# Altium schematic sheet Power.SchDoc
size A; SheetNumber: 1; SheetTotal: 8
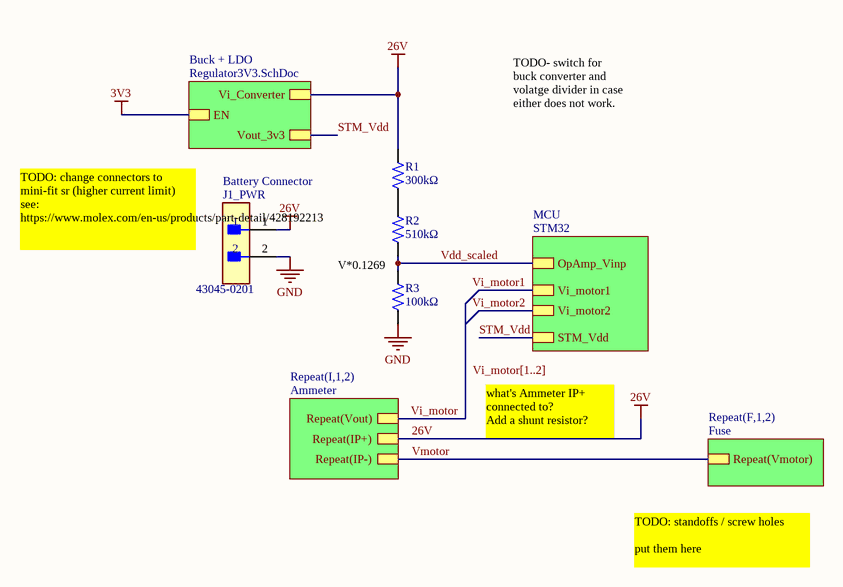
[diagram p0: Power.SchDoc]

## Parts
J1_PWR  43045-0201  [FP-43045-0201-MFG]
R1  Resistance: 300kΩ  [RES-0603]  (hidden comment: 0603WAF3003T5E)
R2  Resistance: 510kΩ  [RES-0603]  (hidden comment: 0603WAF5103T5E)
R3  Resistance: 100kΩ  [RES-0402]  (hidden comment: 0402WGF1003TCE)

## Sub-sheets
Buck + LDO = Regulator3V3.SchDoc: Vi_Converter, Vout_3v3, EN
MCU = STM32: Vi_motor1, Vi_motor2, OpAmp_Vinp, STM_Vdd
Repeat(F,1,2) = Fuse: Repeat(Vmotor)
Repeat(I,1,2) = Ammeter: Repeat(Vout), Repeat(IP-), Repeat(IP+)

## Nets
3V3: sheet Buck + LDO/EN
26V: J1_PWR.1 R1.2 ; sheet Repeat(I,1,2)/Repeat(IP+), sheet Buck + LDO/Vi_Converter
GND: J1_PWR.2 R3.1
STM_Vdd: sheet MCU/STM_Vdd, sheet Buck + LDO/Vout_3v3
Vdd_scaled: R2.1 R3.2 ; sheet MCU/OpAmp_Vinp
Vi_motor: sheet Repeat(I,1,2)/Repeat(Vout)
Vi_motor1: sheet MCU/Vi_motor1
Vi_motor2: sheet MCU/Vi_motor2
Vmotor: sheet Repeat(I,1,2)/Repeat(IP-), sheet Repeat(F,1,2)/Repeat(Vmotor)
NetR1_1: R1.1 R2.2

## Buses and harness runs
bus Vi_motor[1..2]

## Notes on the sheet
- (near J1_PWR) Battery Connector
- TODO- switch for buck converter and volatge divider in case either does not work.
- TODO: change connectors to mini-fit sr (higher current limit)
  see: https://www.molex.com/en-us/products/part-detail/428192213
- V*0.1269
- what's Ammeter IP+ connected to?
  Add a shunt resistor?
- TODO: standoffs / screw holes
  put them here
- Labels drawn without touching a wire or pin: Vi_motor[1..2]

## Library data of the parts
J1_PWR = CMP-04776-000998-1: CONN HEADER R/A 2POS; Number of Circuits: 2; Glow Wire Compliant: Compliant; Pitch: 3mm; Max Voltage Rating (DC): 250.25kV; Current Rating: 5A; Contact Resistance: 10mR; Gender: Male; Voltage Rating: 250V; Number of Positions: 2; Halogen Free: Low Halogen; Series: 43045; Mount: Through Hole; Packaging: Tray; Row Spacing: 3mm; Contact Material: Brass; Radiation Hardening: No; Number of Contacts: 2; Orientation: Right Angle; Max Operating Temperature: 105°C; Housing Material: Thermoplastic; Contact Plating: Gold; Case/Package: 0201; Number of Rows: 2; Min Operating Temperature: -40°C; Termination: Solder; Package Quantity: 3168
R1 = 0603WAF3003T5E: Resistor, 300kΩ, ±1%, 100mW, 75V, ±100ppm/℃, -55℃~+155℃, SMD 0603; Manufacturer: Uniroyal; Supplier 1: LCSC; Manufacturer Part Number: 0603WAF3003T5E; Supplier Part Number 1: C23024; JLCPCB Part Number: C23024; Power Rating: 100mW; Category: Resistors; Package Size: 0603; JLCPCB Basic Part: Yes; Tolerance: ±1%; Voltage Rating: 75V; Temperature Coefficient: ±100ppm/℃; Temperature Rating: -55℃~+155℃; ComponentLink1Description: Datasheet; ComponentLink1URL: https://wmsc.lcsc.com/wmsc/upload/file/pdf/v2/lcsc/2206010116_UNI-ROYAL-Uniroyal-Elec-0603WAF3003T5E_C23024.pdf; ComponentLink2Description: JLCPCB Part URL; ComponentLink2URL: https://jlcpcb.com/partdetail/C23024
R2 = 0603WAF5103T5E: Resistor, 510kΩ, ±1%, 100mW, 75V, ±100ppm/℃, -55℃~+155℃, SMD 0603; Manufacturer: Uniroyal; Supplier 1: LCSC; Manufacturer Part Number: 0603WAF5103T5E; Supplier Part Number 1: C23192; JLCPCB Part Number: C23192; Power Rating: 100mW; Category: Resistors; Package Size: 0603; JLCPCB Basic Part: Yes; Tolerance: ±1%; Voltage Rating: 75V; Temperature Coefficient: ±100ppm/℃; Temperature Rating: -55℃~+155℃; ComponentLink1Description: Datasheet; ComponentLink1URL: https://wmsc.lcsc.com/wmsc/upload/file/pdf/v2/lcsc/2206010116_UNI-ROYAL-Uniroyal-Elec-0603WAF5103T5E_C23192.pdf; ComponentLink2Description: JLCPCB Part URL; ComponentLink2URL: https://jlcpcb.com/partdetail/C23192
R3 = 0402WGF1003TCE: Resistor, 100kΩ, ±1%, 62.5mW, 50V, ±100ppm/℃, -55℃~+155℃, SMD 0402; Manufacturer: Uniroyal; Supplier 1: LCSC; Manufacturer Part Number: 0402WGF1003TCE; Supplier Part Number 1: C25741; JLCPCB Part Number: C25741; Power Rating: 62.5mW; Category: Resistors; Package Size: 0402; JLCPCB Basic Part: Yes; Tolerance: ±1%; Voltage Rating: 50V; Temperature Coefficient: ±100ppm/℃; Temperature Rating: -55℃~+155℃; ComponentLink1Description: Datasheet; ComponentLink1URL: https://wmsc.lcsc.com/wmsc/upload/file/pdf/v2/lcsc/2206010100_UNI-ROYAL-Uniroyal-Elec-0402WGF1003TCE_C25741.pdf; ComponentLink2Description: JLCPCB Part URL; ComponentLink2URL: https://jlcpcb.com/partdetail/C25741